# Altium schematic sheet 00. MAIN.SchDoc
size 297 x 209 mm
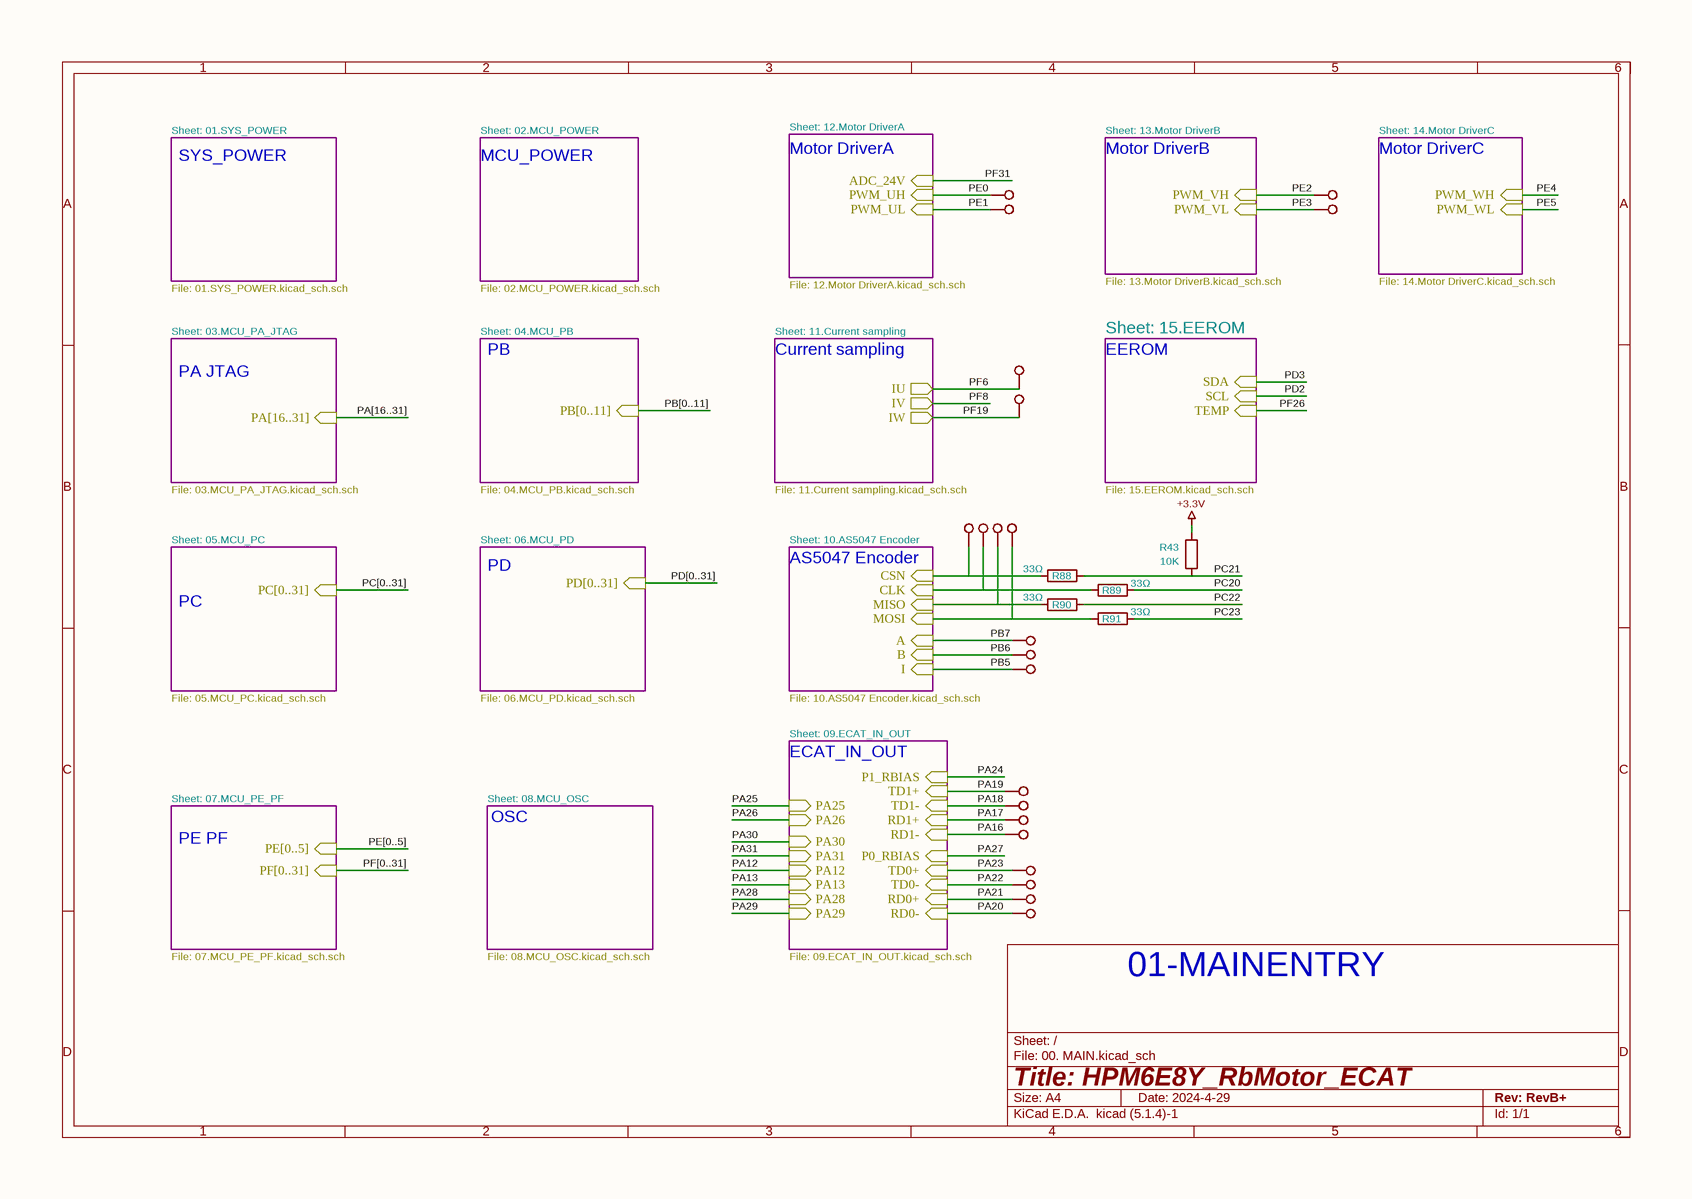
[diagram p0: 00. MAIN.SchDoc]

## Parts
R43  10K  [R_0402_1005Metric]
R88  33Ω  [R_0402_1005Metric]
R89  33Ω  [R_0402_1005Metric]
R90  33Ω  [R_0402_1005Metric]
R91  33Ω  [R_0402_1005Metric]
TP2  0.5mm  [TestPoint_Pad_D0.5mm]  (value not drawn)
TP3  0.5mm  [TestPoint_Pad_D0.5mm]  (value not drawn)
TP9  0.5mm  [TestPoint_Pad_D0.5mm]  (value not drawn)
TP12  0.5mm  [TestPoint_Pad_D0.5mm]  (value not drawn)
TP13  0.5mm  [TestPoint_Pad_D0.5mm]  (value not drawn)
TP15  0.5mm  [TestPoint_Pad_D0.5mm]  (value not drawn)
TP18  0.5mm  [TestPoint_Pad_D0.5mm]  (value not drawn)
TP19  0.5mm  [TestPoint_Pad_D0.5mm]  (value not drawn)
TP20  0.5mm  [TestPoint_Pad_D0.5mm]  (value not drawn)
TP21  0.5mm  [TestPoint_Pad_D0.5mm]  (value not drawn)
TP22  0.5mm  [TestPoint_Pad_D0.5mm]  (value not drawn)
TP23  0.5mm  [TestPoint_Pad_D0.5mm]  (value not drawn)
TP24  0.5mm  [TestPoint_Pad_D0.5mm]  (value not drawn)
TP25  0.5mm  [TestPoint_Pad_D0.5mm]  (value not drawn)
TP26  0.5mm  [TestPoint_Pad_D0.5mm]  (value not drawn)
TP27  0.5mm  [TestPoint_Pad_D0.5mm]  (value not drawn)
TP28  0.5mm  [TestPoint_Pad_D0.5mm]  (value not drawn)
TP29  0.5mm  [TestPoint_Pad_D0.5mm]  (value not drawn)
TP30  0.5mm  [TestPoint_Pad_D0.5mm]  (value not drawn)
TP31  0.5mm  [TestPoint_Pad_D0.5mm]  (value not drawn)
TP32  0.5mm  [TestPoint_Pad_D0.5mm]  (value not drawn)

## Sub-sheets
01.SYS_POWER = 01.SYS_POWER.SchDoc: no entries
02.MCU_POWER = 02.MCU_POWER.SchDoc: no entries
03.MCU_PA_JTAG = 03.MCU_PA_JTAG.SchDoc: PA[16..31] (in)
04.MCU_PB = 04.MCU_PB.SchDoc: PB[0..11] (in)
05.MCU_PC = 05.MCU_PC.SchDoc: PC[0..31] (in)
06.MCU_PD = 06.MCU_PD.SchDoc: PD[0..31] (in)
07.MCU_PE_PF = 07.MCU_PE_PF.SchDoc: PF[0..31] (in), PE[0..5] (in)
08.MCU_OSC = 08.MCU_OSC.SchDoc: no entries
09.ECAT_IN_OUT = 09.ECAT_IN_OUT.SchDoc: P1_RBIAS (in), PA30 (in), PA31 (in), PA12 (in), PA13 (in), TD1+ (in), TD1- (in), RD1+ (in), RD1- (in), RD0- (in), RD0+ (in), TD0- (in), TD0+ (in), P0_RBIAS (in), PA25 (in), PA26 (in), PA29 (in), PA28 (in)
10.AS5047 Encoder = 10.AS5047 Encoder.SchDoc: CLK (in), MISO (in), CSN (in), MOSI (in), I (in), B (in), A (in)
11.Current sampling = 11.Current sampling.SchDoc: IU (out), IV (out), IW (out)
12.Motor DriverA = 12.Motor DriverA.SchDoc: PWM_UH (in), PWM_UL (in), ADC_24V (in)
13.Motor DriverB = 13.Motor DriverB.SchDoc: PWM_VL (in), PWM_VH (in)
14.Motor DriverC = 14.Motor DriverC.SchDoc: PWM_WH (in), PWM_WL (in)
15.EEROM = 15.EEROM.SchDoc: SCL (in), SDA (in), TEMP (in)

## Nets
+3.3V: R43.2
PA12: sheet 09.ECAT_IN_OUT/PA12
PA13: sheet 09.ECAT_IN_OUT/PA13
PA16: TP25.1 ; sheet 09.ECAT_IN_OUT/RD1-
PA17: TP24.1 ; sheet 09.ECAT_IN_OUT/RD1+
PA18: TP23.1 ; sheet 09.ECAT_IN_OUT/TD1-
PA19: TP22.1 ; sheet 09.ECAT_IN_OUT/TD1+
PA20: TP29.1 ; sheet 09.ECAT_IN_OUT/RD0-
PA21: TP28.1 ; sheet 09.ECAT_IN_OUT/RD0+
PA22: TP27.1 ; sheet 09.ECAT_IN_OUT/TD0-
PA23: TP26.1 ; sheet 09.ECAT_IN_OUT/TD0+
PA24: sheet 09.ECAT_IN_OUT/P1_RBIAS
PA25: sheet 09.ECAT_IN_OUT/PA25
PA26: sheet 09.ECAT_IN_OUT/PA26
PA27: sheet 09.ECAT_IN_OUT/P0_RBIAS
PA28: sheet 09.ECAT_IN_OUT/PA28
PA29: sheet 09.ECAT_IN_OUT/PA29
PA30: sheet 09.ECAT_IN_OUT/PA30
PA31: sheet 09.ECAT_IN_OUT/PA31
PA[16..31]: sheet 03.MCU_PA_JTAG/PA[16..31]
PB5: TP32.1 ; sheet 10.AS5047 Encoder/I
PB6: TP31.1 ; sheet 10.AS5047 Encoder/B
PB7: TP30.1 ; sheet 10.AS5047 Encoder/A
PB[0..11]: sheet 04.MCU_PB/PB[0..11]
PC20: R89.2
PC21: R43.1 R88.2
PC22: R90.2
PC23: R91.2
PC[0..31]: sheet 05.MCU_PC/PC[0..31]
PD2: sheet 15.EEROM/SCL
PD3: sheet 15.EEROM/SDA
PD[0..31]: sheet 06.MCU_PD/PD[0..31]
PE0: TP12.1 ; sheet 12.Motor DriverA/PWM_UH
PE1: TP13.1 ; sheet 12.Motor DriverA/PWM_UL
PE2: TP2.1 ; sheet 13.Motor DriverB/PWM_VH
PE3: TP9.1 ; sheet 13.Motor DriverB/PWM_VL
PE4: sheet 14.Motor DriverC/PWM_WH
PE5: sheet 14.Motor DriverC/PWM_WL
PE[0..5]: sheet 07.MCU_PE_PF/PE[0..5]
PF6: TP3.1 ; sheet 11.Current sampling/IU
PF8: sheet 11.Current sampling/IV
PF19: TP15.1 ; sheet 11.Current sampling/IW
PF26: sheet 15.EEROM/TEMP
PF31: sheet 12.Motor DriverA/ADC_24V
PF[0..31]: sheet 07.MCU_PE_PF/PF[0..31]
NetR88_1: R88.1 TP18.1 ; sheet 10.AS5047 Encoder/CSN
NetR89_1: R89.1 TP19.1 ; sheet 10.AS5047 Encoder/CLK
NetR90_1: R90.1 TP20.1 ; sheet 10.AS5047 Encoder/MISO
NetR91_1: R91.1 TP21.1 ; sheet 10.AS5047 Encoder/MOSI

## Notes on the sheet
- Sheet: 01.SYS_POWER
- Sheet: 02.MCU_POWER
- Sheet: 12.Motor DriverA
- Sheet: 13.Motor DriverB
- Sheet: 14.Motor DriverC
- SYS_POWER
- MCU_POWER
- Motor DriverA
- Motor DriverB
- Motor DriverC
- File: 01.SYS_POWER.kicad_sch.sch
- File: 02.MCU_POWER.kicad_sch.sch
- File: 12.Motor DriverA.kicad_sch.sch
- File: 13.Motor DriverB.kicad_sch.sch
- File: 14.Motor DriverC.kicad_sch.sch
- Sheet: 03.MCU_PA_JTAG
- Sheet: 04.MCU_PB
- PB
- Sheet: 11.Current sampling
- Current sampling
- Sheet: 15.EEROM
- EEROM
- PA
  JTAG
- File: 03.MCU_PA_JTAG.kicad_sch.sch
- File: 04.MCU_PB.kicad_sch.sch
- File: 11.Current sampling.kicad_sch.sch
- (near R43) File: 15.EEROM.kicad_sch.sch
- Sheet: 05.MCU_PC
- Sheet: 06.MCU_PD
- PD
- Sheet: 10.AS5047 Encoder
- AS5047 Encoder
- PC
- File: 05.MCU_PC.kicad_sch.sch
- File: 06.MCU_PD.kicad_sch.sch
- File: 10.AS5047 Encoder.kicad_sch.sch
- Sheet: 09.ECAT_IN_OUT
- ECAT_IN_OUT
- Sheet: 07.MCU_PE_PF
- PE
  PF
- Sheet: 08.MCU_OSC
- OSC
- File: 07.MCU_PE_PF.kicad_sch.sch
- File: 08.MCU_OSC.kicad_sch.sch
- File: 09.ECAT_IN_OUT.kicad_sch.sch
- 01-MAINENTRY
- 1
- 2
- 3
- 4
- 5
- 6
- A
- B
- C
- D
- Title: HPM6E8Y_RbMotor_ECAT
- File: 00. MAIN.kicad_sch
- Sheet: /
- KiCad E.D.A.  kicad (5.1.4)-1
- Size: A4
- Date: 2024-4-29
- Rev: RevB+
- Id: 1/1

## Library data of the parts
R43 = 10K_0402: Model: 0402WGF1002TCE; Company: UNI-ROYAL(厚声); Value: 10K; Footprint: 02_HPM_Resistor:R_0402_1005Metric
R88-R91 = 33Ω_0402: Model: 0402WGF330JTCE; Company: UNI-ROYAL(厚声); Value: 33Ω; Footprint: 02_HPM_Resistor:R_0402_1005Metric
TP2 TP3 TP9 TP12 TP13 TP15 TP18-TP32 = TestPoint-0.5mm: Value: 0.5mm; Footprint: 01_HPM_Peripheral:TestPoint_Pad_D0.5mm